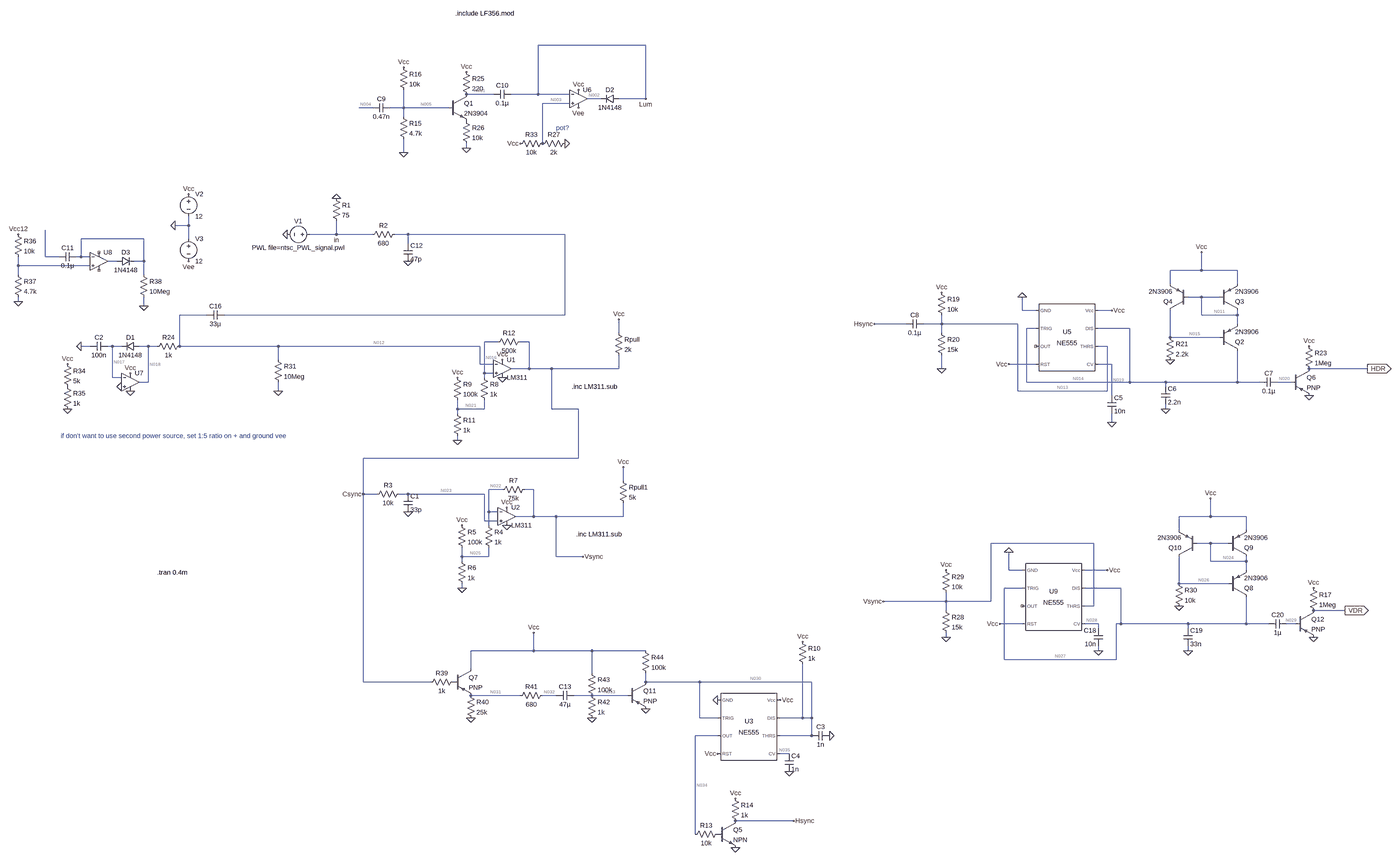
[diagram p0: schematic Tim's Circuit.asc, whole sheet]
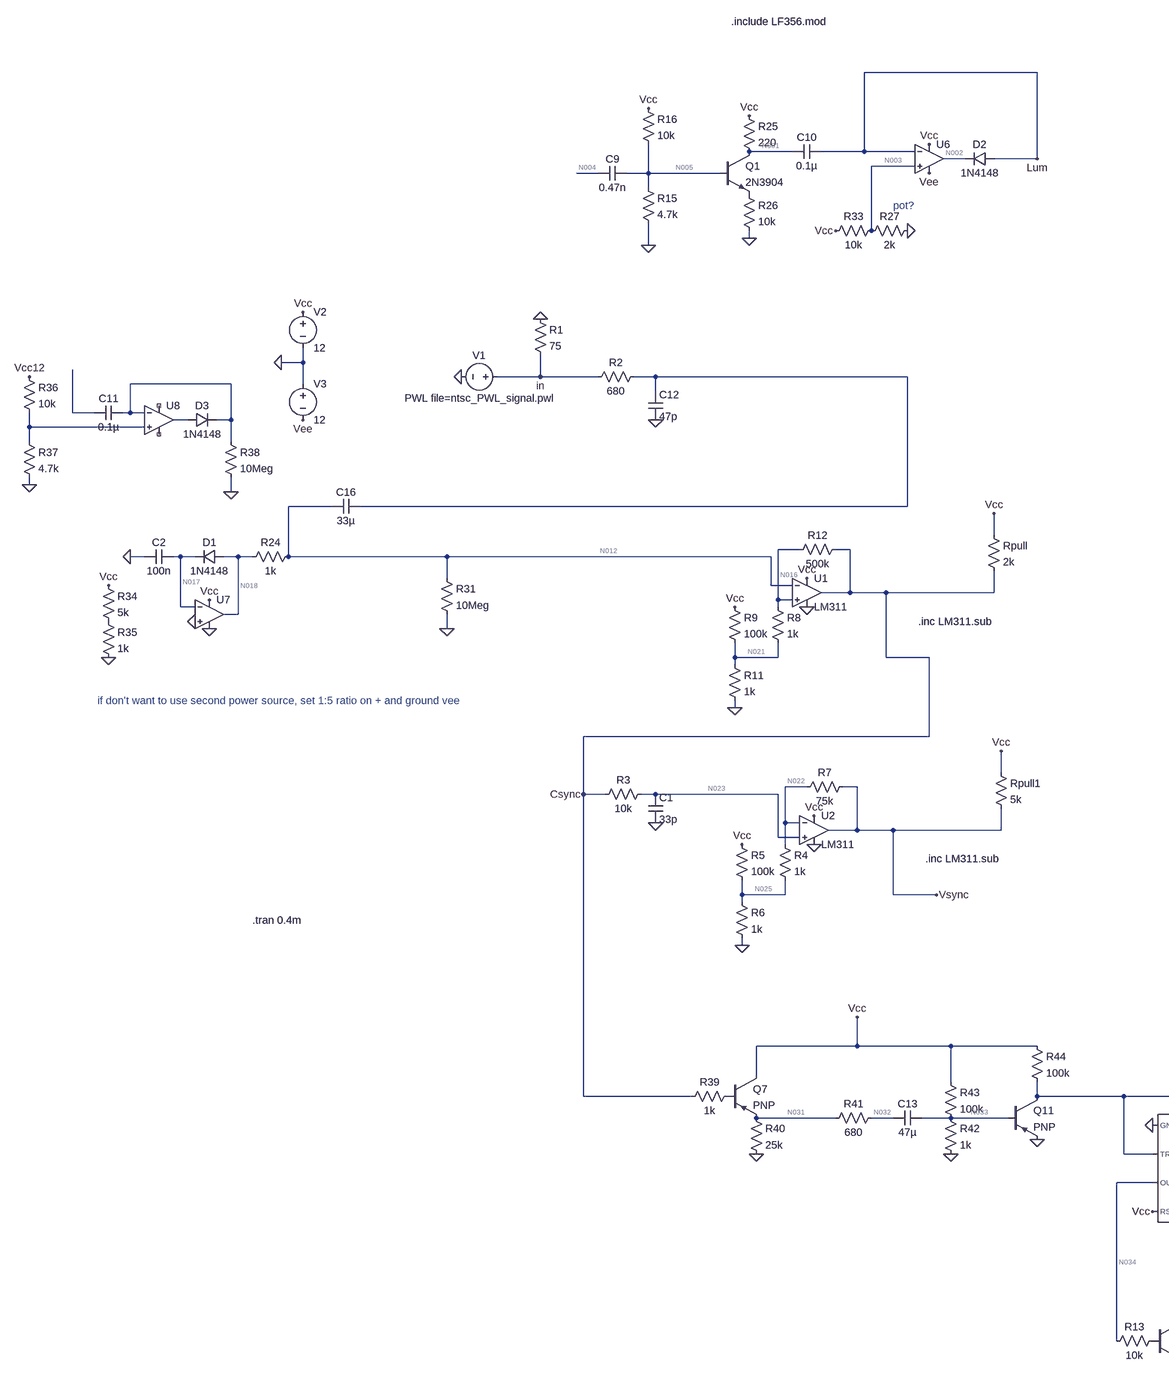
[diagram p1: schematic Tim's Circuit.asc, part, row 1 of 1, column 1 of 2]
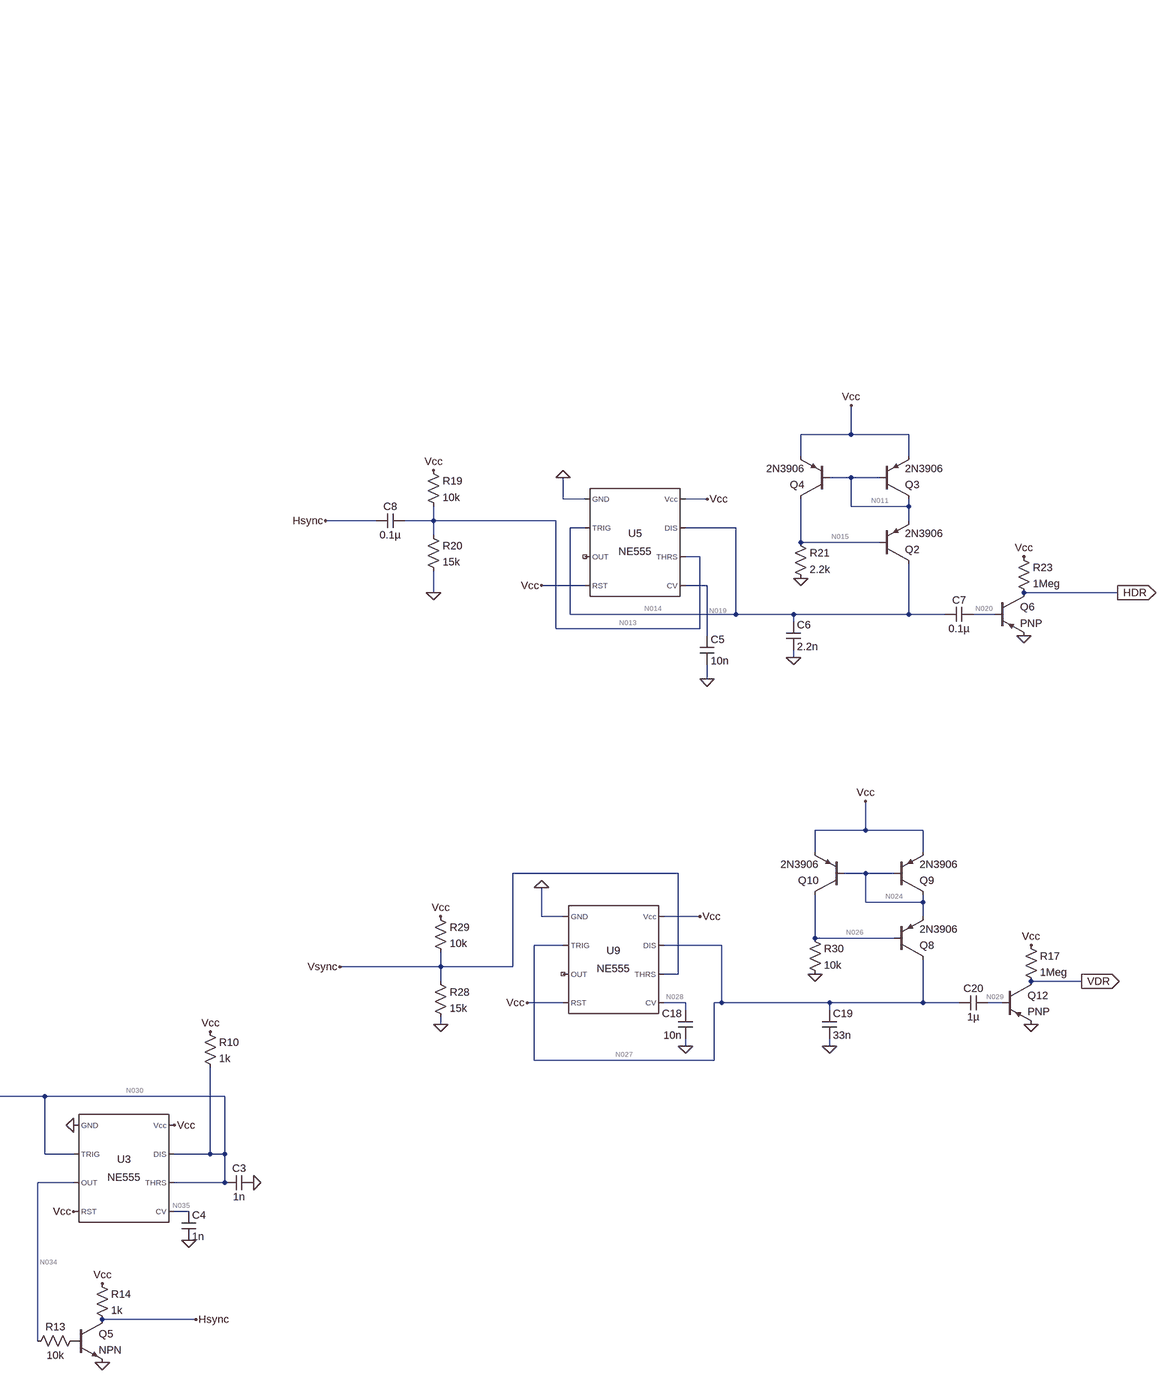
[diagram p2: schematic Tim's Circuit.asc, part, row 1 of 1, column 2 of 2]
Tim's Circuit.asc, the LTspice schematic file:
Version 4.1
SHEET 1 4812 2596
WIRE 1264 -912 880 -912
WIRE 720 -736 624 -736
WIRE 880 -736 880 -912
WIRE 880 -736 784 -736
WIRE 992 -736 880 -736
WIRE 1104 -720 1056 -720
WIRE 1264 -720 1264 -912
WIRE 1264 -720 1168 -720
WIRE 992 -704 896 -704
WIRE 288 -688 240 -688
WIRE 400 -688 400 -752
WIRE 400 -688 352 -688
WIRE 560 -688 400 -688
WIRE 400 -656 400 -688
WIRE 896 -560 896 -704
WIRE 624 -544 624 -560
WIRE 400 -528 400 -576
WIRE -368 -224 -368 -256
WIRE -368 -224 -416 -224
WIRE 160 -192 160 -240
WIRE 160 -192 64 -192
WIRE 288 -192 160 -192
WIRE 416 -192 368 -192
WIRE 976 -192 416 -192
WIRE -528 -176 -752 -176
WIRE -368 -176 -368 -224
WIRE 416 -160 416 -192
WIRE -880 -112 -880 -208
WIRE -832 -112 -880 -112
WIRE -752 -112 -752 -176
WIRE -752 -112 -768 -112
WIRE -720 -112 -752 -112
WIRE -624 -96 -656 -96
WIRE -528 -96 -528 -176
WIRE -528 -96 -560 -96
WIRE -976 -80 -976 -112
WIRE -720 -80 -976 -80
WIRE 3280 -64 3280 -128
WIRE 3280 -64 3168 -64
WIRE 3408 -64 3280 -64
WIRE -976 -48 -976 -80
WIRE -528 -48 -528 -96
WIRE 3168 -16 3168 -64
WIRE 3408 -16 3408 -64
WIRE 3280 32 3232 32
WIRE 3344 32 3280 32
WIRE -976 48 -976 32
WIRE -528 64 -528 32
WIRE 2640 80 2640 32
WIRE 2688 80 2640 80
WIRE 2960 80 2912 80
WIRE -304 96 -400 96
WIRE 976 96 976 -192
WIRE 976 96 -240 96
WIRE 3280 96 3280 32
WIRE 3408 96 3408 80
WIRE 3408 96 3280 96
WIRE 2224 128 2112 128
WIRE 2352 128 2352 96
WIRE 2352 128 2288 128
WIRE 2624 128 2352 128
WIRE 3408 128 3408 96
WIRE 2688 144 2656 144
WIRE 3024 144 2912 144
WIRE 1168 160 1168 112
WIRE 2352 160 2352 128
WIRE 3168 176 3168 80
WIRE 3344 176 3168 176
WIRE 736 192 688 192
WIRE 848 192 816 192
WIRE -720 208 -752 208
WIRE -640 208 -656 208
WIRE -608 208 -640 208
WIRE -512 208 -544 208
WIRE -480 208 -512 208
WIRE -400 208 -400 96
WIRE -48 208 -400 208
WIRE 672 208 -48 208
WIRE 2944 208 2912 208
WIRE -48 256 -48 208
WIRE 672 272 672 208
WIRE 720 272 672 272
WIRE 2688 272 2592 272
WIRE 2960 272 2912 272
WIRE 848 288 848 192
WIRE 848 288 784 288
WIRE 928 288 848 288
WIRE 1168 288 1168 240
WIRE 1168 288 928 288
WIRE 2352 288 2352 240
WIRE 3872 288 3664 288
WIRE 688 304 688 192
WIRE 720 304 688 304
WIRE -640 320 -640 208
WIRE -608 320 -640 320
WIRE 688 320 688 304
WIRE -512 336 -512 208
WIRE -512 336 -544 336
WIRE 2656 336 2656 144
WIRE 3024 336 3024 144
WIRE 3024 336 2656 336
WIRE 3152 336 3024 336
WIRE 3408 336 3408 224
WIRE 3408 336 3152 336
WIRE 3488 336 3408 336
WIRE 3600 336 3552 336
WIRE 3152 352 3152 336
WIRE -48 368 -48 336
WIRE 2624 368 2624 128
WIRE 2944 368 2944 208
WIRE 2944 368 2624 368
WIRE 2960 384 2960 272
WIRE 592 432 592 400
WIRE 688 432 688 400
WIRE 688 432 592 432
WIRE 928 432 928 288
WIRE 1024 432 928 432
WIRE 3152 432 3152 416
WIRE 592 448 592 432
WIRE 2960 480 2960 448
WIRE 592 544 592 528
WIRE 1024 608 1024 432
WIRE 1024 608 256 608
WIRE 1184 688 1184 640
WIRE 752 720 704 720
WIRE 864 720 832 720
WIRE 256 736 256 608
WIRE 304 736 256 736
WIRE 416 736 384 736
WIRE 688 736 416 736
WIRE 704 800 704 720
WIRE 736 800 704 800
WIRE 864 816 864 720
WIRE 864 816 800 816
WIRE 944 816 864 816
WIRE 1184 816 1184 768
WIRE 1184 816 944 816
WIRE 3312 816 3312 752
WIRE 3312 816 3200 816
WIRE 3440 816 3312 816
WIRE 688 832 688 736
WIRE 736 832 688 832
WIRE 704 848 704 800
WIRE 3200 864 3200 816
WIRE 3440 864 3440 816
WIRE 2896 912 2528 912
WIRE 3312 912 3264 912
WIRE 3376 912 3312 912
WIRE 608 960 608 928
WIRE 704 960 704 928
WIRE 704 960 608 960
WIRE 944 960 944 816
WIRE 1040 960 944 960
WIRE 608 976 608 960
WIRE 3312 976 3312 912
WIRE 3440 976 3440 960
WIRE 3440 976 3312 976
WIRE 2592 1008 2592 944
WIRE 2640 1008 2592 1008
WIRE 2944 1008 2864 1008
WIRE 3440 1008 3440 976
WIRE 3200 1056 3200 960
WIRE 3376 1056 3200 1056
WIRE 608 1072 608 1056
WIRE 2640 1072 2576 1072
WIRE 2992 1072 2864 1072
WIRE 2368 1120 2368 1088
WIRE 2368 1120 2144 1120
WIRE 2528 1120 2528 912
WIRE 2528 1120 2368 1120
WIRE 2896 1136 2896 912
WIRE 2896 1136 2864 1136
WIRE 2368 1152 2368 1120
WIRE 3792 1152 3680 1152
WIRE 2640 1200 2560 1200
WIRE 2912 1200 2864 1200
WIRE 2992 1200 2992 1072
WIRE 2992 1200 2976 1200
WIRE 3232 1200 2992 1200
WIRE 3440 1200 3440 1104
WIRE 3440 1200 3232 1200
WIRE 3520 1200 3440 1200
WIRE 3616 1200 3584 1200
WIRE 2912 1216 2912 1200
WIRE 3232 1216 3232 1200
WIRE 2368 1248 2368 1232
WIRE 864 1296 864 1232
WIRE 864 1296 640 1296
WIRE 1072 1296 864 1296
WIRE 1264 1296 1072 1296
WIRE 2912 1296 2912 1280
WIRE 3232 1296 3232 1280
WIRE 2576 1328 2576 1072
WIRE 2976 1328 2976 1200
WIRE 2976 1328 2576 1328
WIRE 640 1360 640 1296
WIRE 1072 1376 1072 1296
WIRE 256 1408 256 736
WIRE 496 1408 256 1408
WIRE 1264 1408 1264 1376
WIRE 1488 1408 1264 1408
WIRE 1888 1408 1488 1408
WIRE 816 1456 640 1456
WIRE 944 1456 896 1456
WIRE 1072 1456 1008 1456
WIRE 1200 1456 1072 1456
WIRE 1488 1536 1488 1408
WIRE 1552 1536 1488 1536
WIRE 1856 1536 1856 1344
WIRE 1856 1536 1776 1536
WIRE 1888 1536 1888 1408
WIRE 1888 1536 1856 1536
WIRE 1552 1600 1472 1600
WIRE 1888 1600 1888 1536
WIRE 1888 1600 1776 1600
WIRE 1808 1664 1776 1664
WIRE 1824 1904 1616 1904
WIRE 1472 1952 1472 1600
FLAG -16 -192 0
FLAG 160 -320 0
FLAG 2352 16 Vcc
FLAG 2352 288 0
FLAG 2640 32 0
FLAG 2960 480 0
FLAG 3152 432 0
FLAG 3168 256 0
FLAG 3872 288 HDR
IOPIN 3872 288 Out
FLAG 2112 128 Hsync
FLAG 416 -96 0
FLAG 592 544 0
FLAG 752 256 Vcc
FLAG -368 -336 Vcc
FLAG -368 -96 Vee
FLAG -416 -224 0
FLAG 2960 80 Vcc
FLAG 3280 -128 Vcc
FLAG 2592 272 Vcc
FLAG 1168 112 Vcc
FLAG 592 320 Vcc
FLAG 752 320 0
FLAG -48 368 0
FLAG 416 800 0
FLAG -752 208 0
FLAG -576 304 Vcc
FLAG 608 1072 0
FLAG 768 784 Vcc
FLAG 1184 640 Vcc
FLAG 608 848 Vcc
FLAG 768 848 0
FLAG 1040 960 Vsync
FLAG 2368 1248 0
FLAG 2368 1008 Vcc
FLAG 2944 1008 Vcc
FLAG 2592 944 0
FLAG 2912 1296 0
FLAG 2560 1200 Vcc
FLAG 3200 1136 0
FLAG 3312 752 Vcc
FLAG 3232 1296 0
FLAG 3792 1152 VDR
IOPIN 3792 1152 Out
FLAG 2144 1120 Vsync
FLAG 256 736 Csync
FLAG 1552 1472 0
FLAG 1776 1472 Vcc
FLAG 1552 1664 Vcc
FLAG 1952 1600 0
FLAG 1856 1264 Vcc
FLAG 1808 1728 0
FLAG 1616 1824 Vcc
FLAG 1616 2000 0
FLAG 1824 1904 Hsync
FLAG 3664 208 Vcc
FLAG 3664 384 0
FLAG 400 -528 0
FLAG 624 -816 Vcc
FLAG 624 -544 0
FLAG 400 -832 Vcc
FLAG 1024 -688 Vee
FLAG 1024 -752 Vcc
FLAG 816 -560 Vcc
FLAG 976 -560 0
FLAG 1264 -720 Lum
FLAG -800 432 0
FLAG -800 272 Vcc
FLAG -976 48 0
FLAG -976 -192 Vcc12
FLAG -528 64 0
FLAG -576 368 0
FLAG -608 352 0
FLAG 160 -192 in
FLAG 640 1536 0
FLAG 1072 1536 0
FLAG 864 1232 Vcc
FLAG 1264 1504 0
FLAG 3680 1072 Vcc
FLAG 3680 1248 0
DATAFLAG 592 432 ""
DATAFLAG 608 960 ""
SYMBOL voltage 80 -192 R90
WINDOW 0 -32 56 VBottom 2
WINDOW 3 32 56 VTop 2
WINDOW 123 0 0 Left 0
WINDOW 39 0 0 Left 0
SYMATTR InstName V1
SYMATTR Value PWL file=ntsc_PWL_signal.pwl
SYMBOL res 144 -336 R0
SYMATTR InstName R1
SYMATTR Value 75
SYMBOL Misc\\NE555 2800 176 R0
SYMATTR InstName U5
SYMBOL res 2336 0 R0
SYMATTR InstName R19
SYMATTR Value 10k
SYMBOL res 2336 144 R0
SYMATTR InstName R20
SYMATTR Value 15k
SYMBOL cap 2944 384 R0
SYMATTR InstName C5
SYMATTR Value 10n
SYMBOL cap 3136 352 R0
SYMATTR InstName C6
SYMATTR Value 2.2n
SYMBOL cap 3552 320 R90
WINDOW 0 0 32 VBottom 2
WINDOW 3 32 32 VTop 2
SYMATTR InstName C7
SYMATTR Value 0.1µ
SYMBOL pnp 3344 224 M180
SYMATTR InstName Q2
SYMATTR Value 2N3906
SYMBOL pnp 3344 80 M180
SYMATTR InstName Q3
SYMATTR Value 2N3906
SYMBOL pnp 3232 80 R180
SYMATTR InstName Q4
SYMATTR Value 2N3906
SYMBOL res 3152 160 R0
SYMATTR InstName R21
SYMATTR Value 2.2k
SYMBOL cap 2288 112 R90
WINDOW 0 0 32 VBottom 2
WINDOW 3 32 32 VTop 2
SYMATTR InstName C8
SYMATTR Value 0.1µ
SYMBOL res 384 -208 R90
WINDOW 0 0 56 VBottom 2
WINDOW 3 32 56 VTop 2
SYMATTR InstName R2
SYMATTR Value 680
SYMBOL cap 400 -160 R0
SYMATTR InstName C12
SYMATTR Value 47p
SYMBOL res 672 304 R0
SYMATTR InstName R8
SYMATTR Value 1k
SYMBOL res 576 304 R0
SYMATTR InstName R9
SYMATTR Value 100k
SYMBOL res 576 432 R0
SYMATTR InstName R11
SYMATTR Value 1k
SYMBOL res 832 176 R90
WINDOW 0 0 56 VBottom 2
WINDOW 3 32 56 VTop 2
SYMATTR InstName R12
SYMATTR Value 500k
SYMBOL res 1152 144 R0
SYMATTR InstName Rpull
SYMATTR Value 2k
SYMBOL voltage -368 -352 R0
WINDOW 123 0 0 Left 0
WINDOW 39 0 0 Left 0
SYMATTR InstName V2
SYMATTR Value 12
SYMBOL voltage -368 -192 R0
SYMATTR InstName V3
SYMATTR Value 12
SYMBOL OpAmps\\opamp2 752 224 R0
SYMATTR InstName U1
SYMATTR Value LM311
SYMBOL res -64 240 R0
SYMATTR InstName R31
SYMATTR Value 10Meg
SYMBOL res 400 720 R90
WINDOW 0 0 56 VBottom 2
WINDOW 3 32 56 VTop 2
SYMATTR InstName R3
SYMATTR Value 10k
SYMBOL cap 400 736 R0
SYMATTR InstName C1
SYMATTR Value 33p
SYMBOL res -384 192 R90
WINDOW 0 0 56 VBottom 2
WINDOW 3 32 56 VTop 2
SYMATTR InstName R24
SYMATTR Value 1k
SYMBOL diode -544 192 R90
WINDOW 0 0 32 VBottom 2
WINDOW 3 32 32 VTop 2
SYMATTR InstName D1
SYMATTR Value 1N4148
SYMBOL cap -656 192 R90
WINDOW 0 0 32 VBottom 2
WINDOW 3 32 32 VTop 2
SYMATTR InstName C2
SYMATTR Value 100n
SYMBOL OpAmps\\UniversalOpAmp2 -576 336 R0
SYMATTR InstName U7
SYMBOL cap -240 80 R90
WINDOW 0 0 32 VBottom 2
WINDOW 3 32 32 VTop 2
SYMATTR InstName C16
SYMATTR Value 33µ
SYMBOL res 688 832 R0
SYMATTR InstName R4
SYMATTR Value 1k
SYMBOL res 592 832 R0
SYMATTR InstName R5
SYMATTR Value 100k
SYMBOL res 592 960 R0
SYMATTR InstName R6
SYMATTR Value 1k
SYMBOL res 848 704 R90
WINDOW 0 0 56 VBottom 2
WINDOW 3 32 56 VTop 2
SYMATTR InstName R7
SYMATTR Value 75k
SYMBOL res 1168 672 R0
SYMATTR InstName Rpull1
SYMATTR Value 5k
SYMBOL OpAmps\\opamp2 768 752 R0
SYMATTR InstName U2
SYMATTR Value LM311
SYMBOL res 2352 1136 R0
SYMATTR InstName R28
SYMATTR Value 15k
SYMBOL res 2352 992 R0
SYMATTR InstName R29
SYMATTR Value 10k
SYMBOL Misc\\NE555 2752 1104 R0
SYMATTR InstName U9
SYMBOL cap 2928 1280 R180
WINDOW 0 24 56 Left 2
WINDOW 3 24 8 Left 2
SYMATTR InstName C18
SYMATTR Value 10n
SYMBOL pnp 3376 1104 M180
SYMATTR InstName Q8
SYMATTR Value 2N3906
SYMBOL pnp 3376 960 M180
SYMATTR InstName Q9
SYMATTR Value 2N3906
SYMBOL pnp 3264 960 R180
SYMATTR InstName Q10
SYMATTR Value 2N3906
SYMBOL res 3184 1040 R0
SYMATTR InstName R30
SYMATTR Value 10k
SYMBOL cap 3216 1216 R0
SYMATTR InstName C19
SYMATTR Value 33n
SYMBOL cap 3584 1184 R90
WINDOW 0 0 32 VBottom 2
WINDOW 3 32 32 VTop 2
SYMATTR InstName C20
SYMATTR Value 1µ
SYMBOL Misc\\NE555 1664 1568 R0
SYMATTR InstName U3
SYMBOL cap 1952 1584 R90
WINDOW 0 0 32 VBottom 2
WINDOW 3 32 32 VTop 2
SYMATTR InstName C3
SYMATTR Value 1n
SYMBOL res 1840 1248 R0
SYMATTR InstName R10
SYMATTR Value 1k
SYMBOL cap 1792 1664 R0
SYMATTR InstName C4
SYMATTR Value 1n
SYMBOL res 1568 1936 R90
WINDOW 0 0 56 VBottom 2
WINDOW 3 32 56 VTop 2
SYMATTR InstName R13
SYMATTR Value 10k
SYMBOL npn 1552 1904 R0
SYMATTR InstName Q5
SYMBOL res 1600 1808 R0
SYMATTR InstName R14
SYMATTR Value 1k
SYMBOL res 3648 192 R0
SYMATTR InstName R23
SYMATTR Value 1Meg
SYMBOL pnp 3600 288 R0
SYMATTR InstName Q6
SYMBOL cap 352 -704 R90
WINDOW 0 0 32 VBottom 2
WINDOW 3 32 32 VTop 2
SYMATTR InstName C9
SYMATTR Value 0.47n
SYMBOL res 384 -672 R0
SYMATTR InstName R15
SYMATTR Value 4.7k
SYMBOL res 384 -848 R0
SYMATTR InstName R16
SYMATTR Value 10k
SYMBOL npn 560 -736 R0
SYMATTR InstName Q1
SYMATTR Value 2N3904
SYMBOL res 608 -832 R0
SYMATTR InstName R25
SYMATTR Value 220
SYMBOL cap 784 -752 R90
WINDOW 0 0 32 VBottom 2
WINDOW 3 32 32 VTop 2
SYMATTR InstName C10
SYMATTR Value 0.1µ
SYMBOL res 608 -656 R0
SYMATTR InstName R26
SYMATTR Value 10k
SYMBOL diode 1168 -736 R90
WINDOW 0 0 32 VBottom 2
WINDOW 3 32 32 VTop 2
SYMATTR InstName D2
SYMATTR Value 1N4148
SYMBOL res 992 -576 R90
WINDOW 0 0 56 VBottom 2
WINDOW 3 32 56 VTop 2
SYMATTR InstName R27
SYMATTR Value 2k
SYMBOL res 912 -576 R90
WINDOW 0 0 56 VBottom 2
WINDOW 3 32 56 VTop 2
SYMATTR InstName R33
SYMATTR Value 10k
SYMBOL res -816 256 R0
SYMATTR InstName R34
SYMATTR Value 5k
SYMBOL res -816 336 R0
SYMATTR InstName R35
SYMATTR Value 1k
SYMBOL OpAmps\\UniversalOpAmp2 1024 -720 R0
SYMATTR InstName U6
SYMATTR Value2 Avol=3500 GBW=300Meg Slew=1400Meg
SYMATTR SpiceLine Ilimit=60m Rail=0 Vos=0
SYMBOL cap -768 -128 R90
WINDOW 0 0 32 VBottom 2
WINDOW 3 32 32 VTop 2
SYMATTR InstName C11
SYMATTR Value 0.1µ
SYMBOL OpAmps\\UniversalOpAmp2 -688 -96 R0
SYMATTR InstName U8
SYMBOL res -992 -208 R0
SYMATTR InstName R36
SYMATTR Value 10k
SYMBOL res -992 -64 R0
SYMATTR InstName R37
SYMATTR Value 4.7k
SYMBOL diode -624 -80 R270
WINDOW 0 32 32 VTop 2
WINDOW 3 0 32 VBottom 2
SYMATTR InstName D3
SYMATTR Value 1N4148
SYMBOL res -544 -64 R0
SYMATTR InstName R38
SYMATTR Value 10Meg
SYMBOL res 592 1392 R90
WINDOW 0 0 56 VBottom 2
WINDOW 3 32 56 VTop 2
SYMATTR InstName R39
SYMATTR Value 1k
SYMBOL pnp 576 1360 R0
SYMATTR InstName Q7
SYMBOL res 624 1440 R0
SYMATTR InstName R40
SYMATTR Value 25k
SYMBOL res 912 1440 R90
WINDOW 0 0 56 VBottom 2
WINDOW 3 32 56 VTop 2
SYMATTR InstName R41
SYMATTR Value 680
SYMBOL cap 1008 1440 R90
WINDOW 0 0 32 VBottom 2
WINDOW 3 32 32 VTop 2
SYMATTR InstName C13
SYMATTR Value 47µ
SYMBOL res 1056 1440 R0
SYMATTR InstName R42
SYMATTR Value 1k
SYMBOL res 1056 1360 R0
SYMATTR InstName R43
SYMATTR Value 100k
SYMBOL pnp 1200 1408 R0
SYMATTR InstName Q11
SYMBOL res 1248 1280 R0
SYMATTR InstName R44
SYMATTR Value 100k
SYMBOL res 3664 1056 R0
SYMATTR InstName R17
SYMATTR Value 1Meg
SYMBOL pnp 3616 1152 R0
SYMATTR InstName Q12
TEXT -480 1016 Left 2 !.tran 0.4m
TEXT 1000 352 Left 2 !.inc LM311.sub
TEXT 1016 880 Left 2 !.inc LM311.sub
TEXT 944 -616 Left 2 ;pot?
TEXT 584 -1104 Left 2 !.include LF356.mod
TEXT -824 528 Left 2 ;if don't want to use second power source, set 1:5 ratio on + and ground vee

The netlist it stands for:
* Tim's Circuit.asc
V1 in 0 PWL file=ntsc_PWL_signal.pwl
R1 0 in 75
X§U5 0 N014 NC_01 Vcc N019 N013 N014 Vcc NE555  ; pins GND TRIG OUT RST CV THRS DIS Vcc
R19 Vcc N013 10k
R20 N013 0 15k
C5 N019 0 10n
C6 N014 0 2.2n
C7 N020 N014 0.1µ
Q2 N014 N015 N011 0 2N3906
Q3 N011 N011 Vcc 0 2N3906
Q4 N015 N011 Vcc 0 2N3906
R21 N015 0 2.2k
C8 N013 Hsync 0.1µ
R2 N006 in 680
C12 N006 0 47p
R8 N016 N021 1k
R9 Vcc N021 100k
R11 N021 0 1k
R12 Csync N016 500k
Rpull Vcc Csync 2k
V2 Vcc 0 12
V3 0 Vee 12
X§U1 N016 N012 Vcc 0 Csync LM311  ; pins In+ In- V+ V- OUT
R31 N012 0 10Meg
R3 N023 Csync 10k
C1 N023 0 33p
R24 N012 N018 1k
D1 N018 N017 1N4148
C2 N017 0 100n
X§U7 0 N017 Vcc 0 N018 level2 Avol=1Meg GBW=10Meg Slew=10Meg Ilimit=25m Rail=0 Vos=0 En=0 Enk=0 In=0 Ink=0 Rin=500Meg  ; pins In+ In- V+ V- OUT
C16 N006 N012 33µ
R4 N022 N025 1k
R5 Vcc N025 100k
R6 N025 0 1k
R7 Vsync N022 75k
Rpull1 Vcc Vsync 5k
X§U2 N023 N022 Vcc 0 Vsync LM311  ; pins In+ In- V+ V- OUT
R28 Vsync 0 15k
R29 Vcc Vsync 10k
X§U9 0 N027 NC_02 Vcc N028 Vsync N027 Vcc NE555  ; pins GND TRIG OUT RST CV THRS DIS Vcc
C18 0 N028 10n
Q8 N027 N026 N024 0 2N3906
Q9 N024 N024 Vcc 0 2N3906
Q10 N026 N024 Vcc 0 2N3906
R30 N026 0 10k
C19 N027 0 33n
C20 N029 N027 1µ
X§U3 0 N030 N034 Vcc N035 N030 N030 Vcc NE555  ; pins GND TRIG OUT RST CV THRS DIS Vcc
C3 0 N030 1n
R10 Vcc N030 1k
C4 N035 0 1n
R13 P001 N034 10k
Q5 Hsync P001 0 0 NPN
R14 Vcc Hsync 1k
R23 Vcc HDR 1Meg
Q6 HDR N020 0 0 PNP
C9 N005 N004 0.47n
R15 N005 0 4.7k
R16 Vcc N005 10k
Q1 N001 N005 P002 0 2N3904
R25 Vcc N001 220
C10 Lum N001 0.1µ
R26 P002 0 10k
D2 Lum N002 1N4148
R27 0 N003 2k
R33 N003 Vcc 10k
R34 Vcc P003 5k
R35 P003 0 1k
X§U6 N003 Lum Vcc Vee N002 level2 Avol=3500 GBW=300Meg Slew=1400Meg Ilimit=60m Rail=0 Vos=0 En=0 Enk=0 In=0 Ink=0 Rin=500Meg  ; pins In+ In- V+ V- OUT
C11 N007 N008 0.1µ
X§U8 N010 N007 NC_03 NC_04 N009 level2 Avol=1Meg GBW=10Meg Slew=10Meg Ilimit=25m Rail=0 Vos=0 En=0 Enk=0 In=0 Ink=0 Rin=500Meg  ; pins In+ In- V+ V- OUT
R36 Vcc12 N010 10k
R37 N010 0 4.7k
D3 N009 N007 1N4148
R38 N007 0 10Meg
R39 P004 Csync 1k
Q7 Vcc P004 N031 0 PNP
R40 N031 0 25k
R41 N032 N031 680
C13 N033 N032 47µ
R42 N033 0 1k
R43 Vcc N033 100k
Q11 N030 N033 0 0 PNP
R44 Vcc N030 100k
R17 Vcc VDR 1Meg
Q12 VDR N029 0 0 PNP
.model D D
.lib standard.dio
.model NPN NPN
.model PNP PNP
.lib standard.bjt
.tran 0.4m
.inc LM311.sub
.inc LM311.sub
* pot?
.include LF356.mod
* if don't want to use second power source, set 1:5 ratio on + and ground vee
.lib NE555.sub
.lib UniversalOpAmp2.lib
.backanno
.end

* Results of the author's LTspice run, read from the files saved beside the schematic
* Operating Point, zero values left out:
*   V(n019) = 8 V
*   V(n021) = 142.2 mV
*   V(n018) = 14.96 µV
*   V(n026) = 10.67 V
*   V(n005) = 3.834 V
*   V(n002) = 12 V
*   V(n033) = 3.81 V
*   V(n014) = 11.32 V
*   V(hsync) = 68.67 mV
*   V(n027) = 11.36 V
*   V(n035) = 8 V
*   V(n001) = 11.93 V
*   V(n020) = 11.7 V
*   V(vee) = -12 V
*   V(n022) = 361.3 mV
*   V(n029) = 11.7 V
*   V(p003) = 2 V
*   V(p004) = 11.95 V
*   V(vcc) = 12 V
*   V(n016) = 165.7 mV
*   V(n028) = 8 V
*   V(hdr) = 12 V
*   V(lum) = 1.265 V
*   V(n034) = 11.99 V
*   V(n011) = 11.32 V
*   V(n023) = 11.95 V
*   V(vsync) = 9.486 V
*   V(n032) = 298.8 nV
*   V(n013) = 7.2 V
*   V(csync) = 11.95 V
*   V(n017) = 4.738 V
*   V(n024) = 11.36 V
*   V(n004) = 3.834 V
*   V(n003) = 2 V
*   V(p001) = 842.3 mV
*   V(p002) = 3.21 V
*   V(vdr) = 12 V
*   V(n030) = 4.618 V
*   V(n015) = 10.55 V
*   V(n012) = 214.2 µV
*   V(n025) = 239.5 mV
*   V(n031) = 298.8 nV
*   I(R25) = 320 µA
*   I(R11) = 142.2 µA
*   Ic(Q10) = -532.7 µA
*   Ib(Q10) = -2.649 µA
*   Ie(Q10) = 535.4 µA
*   Ic(Q3) = -2.378 mA
*   Ib(Q3) = -11.96 µA
*   Ie(Q3) = 2.39 mA
*   I(R15) = 815.7 µA
*   Ic(Q5) = 11.93 mA
*   Ib(Q5) = 1.115 mA
*   Ie(Q5) = -13.05 mA
*   I(R33) = -1 mA
*   I(R17) = 23.1 pA
*   I(R31) = 21.42 pA
*   I(Rpull1) = 502.7 µA
*   I(Rpull) = 23.57 µA
*   Ib(Q7) = 11.91 pA
*   Ie(Q7) = -11.95 pA
*   I(R5) = 117.6 µA
*   I(R26) = 321 µA
*   I(R10) = 7.382 mA
*   I(R19) = 480 µA
*   I(R21) = 4.798 mA
*   I(R43) = 81.9 µA
*   I(V3) = -2.976 µA
*   I(R23) = 23.1 pA
*   Ic(Q2) = -26.41 nA
*   Ib(Q2) = -2.402 mA
*   Ie(Q2) = 2.402 mA
*   Ic(Q9) = -529.1 µA
*   Ib(Q9) = -2.649 µA
*   Ie(Q9) = 531.7 µA
*   I(R9) = 118.6 µA
*   Ic(Q1) = 320 µA
*   Ib(Q1) = 987.5 nA
*   Ie(Q1) = -321 µA
*   I(R29) = 251.4 µA
*   I(R35) = 2 mA
*   I(R13) = -1.115 mA
*   I(R7) = 121.7 µA
*   I(R27) = -1 mA
*   I(R44) = 73.82 µA
*   I(D1) = -2.525 nA
*   I(R39) = -11.91 pA
*   I(R12) = 23.57 µA
*   I(R30) = 1.067 mA
*   I(R4) = 121.9 µA
*   Ic(Q4) = -2.396 mA
*   Ib(Q4) = -11.96 µA
*   Ie(Q4) = 2.408 mA
*   Ic(Q12) = 23.1 pA
*   Ie(Q12) = -23.1 pA
*   I(R14) = 11.93 mA
*   I(R8) = 23.57 µA
*   I(R3) = -23.32 pA
*   I(R28) = 632.4 µA
*   Ic(Q8) = -26.51 nA
*   Ib(Q8) = -534.3 µA
*   Ie(Q8) = 534.4 µA
*   I(V2) = -47.53 mA
*   I(R42) = 3.81 mA
*   I(R16) = 816.6 µA
*   I(R34) = 2 mA
*   I(R20) = 480 µA
*   I(R24) = 199.3 nA
*   I(R6) = 239.5 µA
*   Ic(Q6) = 23.1 pA
*   Ie(Q6) = -23.1 pA
*   I(R40) = 11.95 pA
*   I(D2) = -2.531 nA
*   Ic(Q11) = 7.456 mA
*   Ib(Q11) = -3.728 mA
*   Ie(Q11) = -3.728 mA